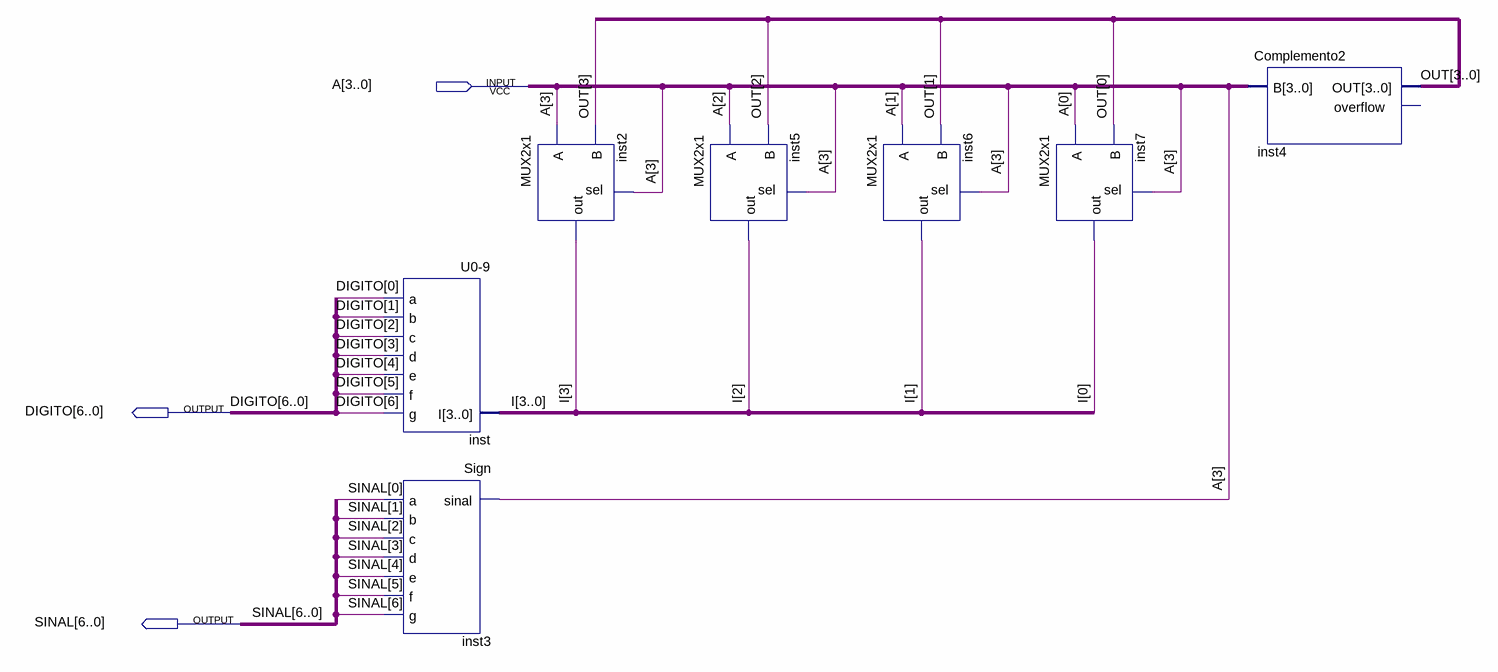
[diagram p0: schematic sheet]
// Quartus schematic DisplayULA.bdf as structural Verilog: 7 symbols, 3 pins
module DisplayULA (
  input  [3:0] A,
  output [6:0] DIGITO,
  output [6:0] SINAL
);

  wire [3:0] I, OUT;

  \U0-9  inst (
    .I(I), .a(DIGITO[0]), .b(DIGITO[1]), .c(DIGITO[2]), .d(DIGITO[3]), .e(DIGITO[4]), .f(DIGITO[5]),
    .g(DIGITO[6]));
  Sign inst3 (
    .sinal(A[3]), .a(SINAL[0]), .b(SINAL[1]), .c(SINAL[2]), .d(SINAL[3]), .e(SINAL[4]), .f(SINAL[5]),
    .g(SINAL[6]));
  MUX2x1 inst2 (.sel(A[3]), .B(OUT[3]), .A(A[3]), .out(I[3]));
  MUX2x1 inst5 (.sel(A[3]), .B(OUT[2]), .A(A[2]), .out(I[2]));
  MUX2x1 inst6 (.sel(A[3]), .B(OUT[1]), .A(A[1]), .out(I[1]));
  MUX2x1 inst7 (.sel(A[3]), .B(OUT[0]), .A(A[0]), .out(I[0]));
  Complemento2 inst4 (.B(A), .OUT(OUT));  // open: overflow
endmodule
